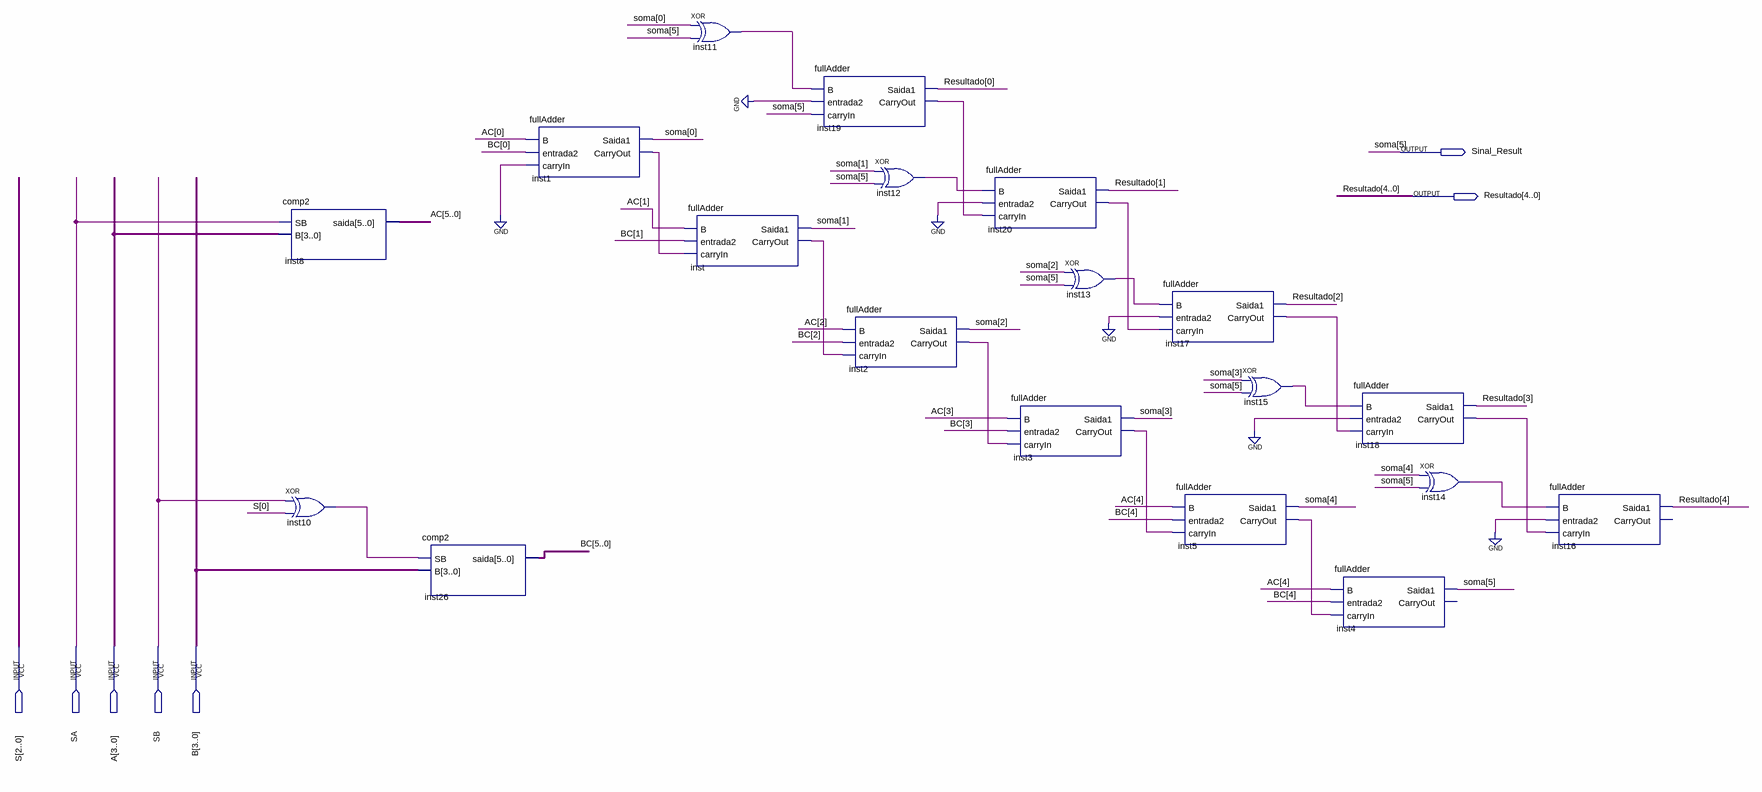
[diagram p0: schematic sheet]
// Quartus schematic somador_subtrator.bdf as structural Verilog: 19 symbols, 7 pins
module somador_subtrator (
  input  [2:0] S,
  input  SA,
  input  [3:0] A,
  input  SB,
  input  [3:0] B,
  output Sinal_Result,
  output [4:0] Resultado
);

  wire inst1_carryout, inst2_carryout, inst3_carryout, inst5_carryout, inst10_out, inst11_out, inst12_out,
       inst13_out, inst14_out, inst15_out, inst17_carryout, inst18_carryout, inst19_carryout,
       inst20_carryout, inst_carryout;
  wire [4:0] soma;
  wire [5:0] AC, BC;

  comp2 inst8 (.SB(SA), .B(A), .saida(AC));
  xor inst10 (inst10_out, SB, S[0]);
  comp2 inst26 (.SB(inst10_out), .B(B), .saida(BC));
  fullAdder inst1 (.B(AC[0]), .entrada2(BC[0]), .carryIn(1'b0), .Saida1(soma[0]), .CarryOut(inst1_carryout));
  xor inst11 (inst11_out, soma[0], Sinal_Result);
  fullAdder inst (.B(AC[1]), .entrada2(BC[1]), .carryIn(inst1_carryout), .Saida1(soma[1]), .CarryOut(inst_carryout));
  fullAdder inst19 (
    .B(inst11_out), .entrada2(1'b0), .carryIn(Sinal_Result), .Saida1(Resultado[0]), .CarryOut(inst19_carryout));
  xor inst12 (inst12_out, soma[1], Sinal_Result);
  fullAdder inst2 (.B(AC[2]), .entrada2(BC[2]), .carryIn(inst_carryout), .Saida1(soma[2]), .CarryOut(inst2_carryout));
  fullAdder inst20 (
    .B(inst12_out), .entrada2(1'b0), .carryIn(inst19_carryout), .Saida1(Resultado[1]),
    .CarryOut(inst20_carryout));
  fullAdder inst3 (.B(AC[3]), .entrada2(BC[3]), .carryIn(inst2_carryout), .Saida1(soma[3]), .CarryOut(inst3_carryout));
  xor inst13 (inst13_out, soma[2], Sinal_Result);
  fullAdder inst17 (
    .B(inst13_out), .entrada2(1'b0), .carryIn(inst20_carryout), .Saida1(Resultado[2]),
    .CarryOut(inst17_carryout));
  fullAdder inst5 (.B(AC[4]), .entrada2(BC[4]), .carryIn(inst3_carryout), .Saida1(soma[4]), .CarryOut(inst5_carryout));
  xor inst15 (inst15_out, soma[3], Sinal_Result);
  fullAdder inst4 (.B(AC[4]), .entrada2(BC[4]), .carryIn(inst5_carryout), .Saida1(Sinal_Result));  // open: CarryOut
  fullAdder inst18 (
    .B(inst15_out), .entrada2(1'b0), .carryIn(inst17_carryout), .Saida1(Resultado[3]),
    .CarryOut(inst18_carryout));
  xor inst14 (inst14_out, soma[4], Sinal_Result);
  fullAdder inst16 (
    .B(inst14_out), .entrada2(1'b0), .carryIn(inst18_carryout), .Saida1(Resultado[4]));  // open: CarryOut

  // Other names for the same wires on the sheet: soma[5] = Sinal_Result
endmodule
